# Altium schematic sheet [15] - MISC, JTAG, HEADERS.SchDoc
size A3; DocumentNumber: 2; SheetNumber: 15; SheetTotal: 20
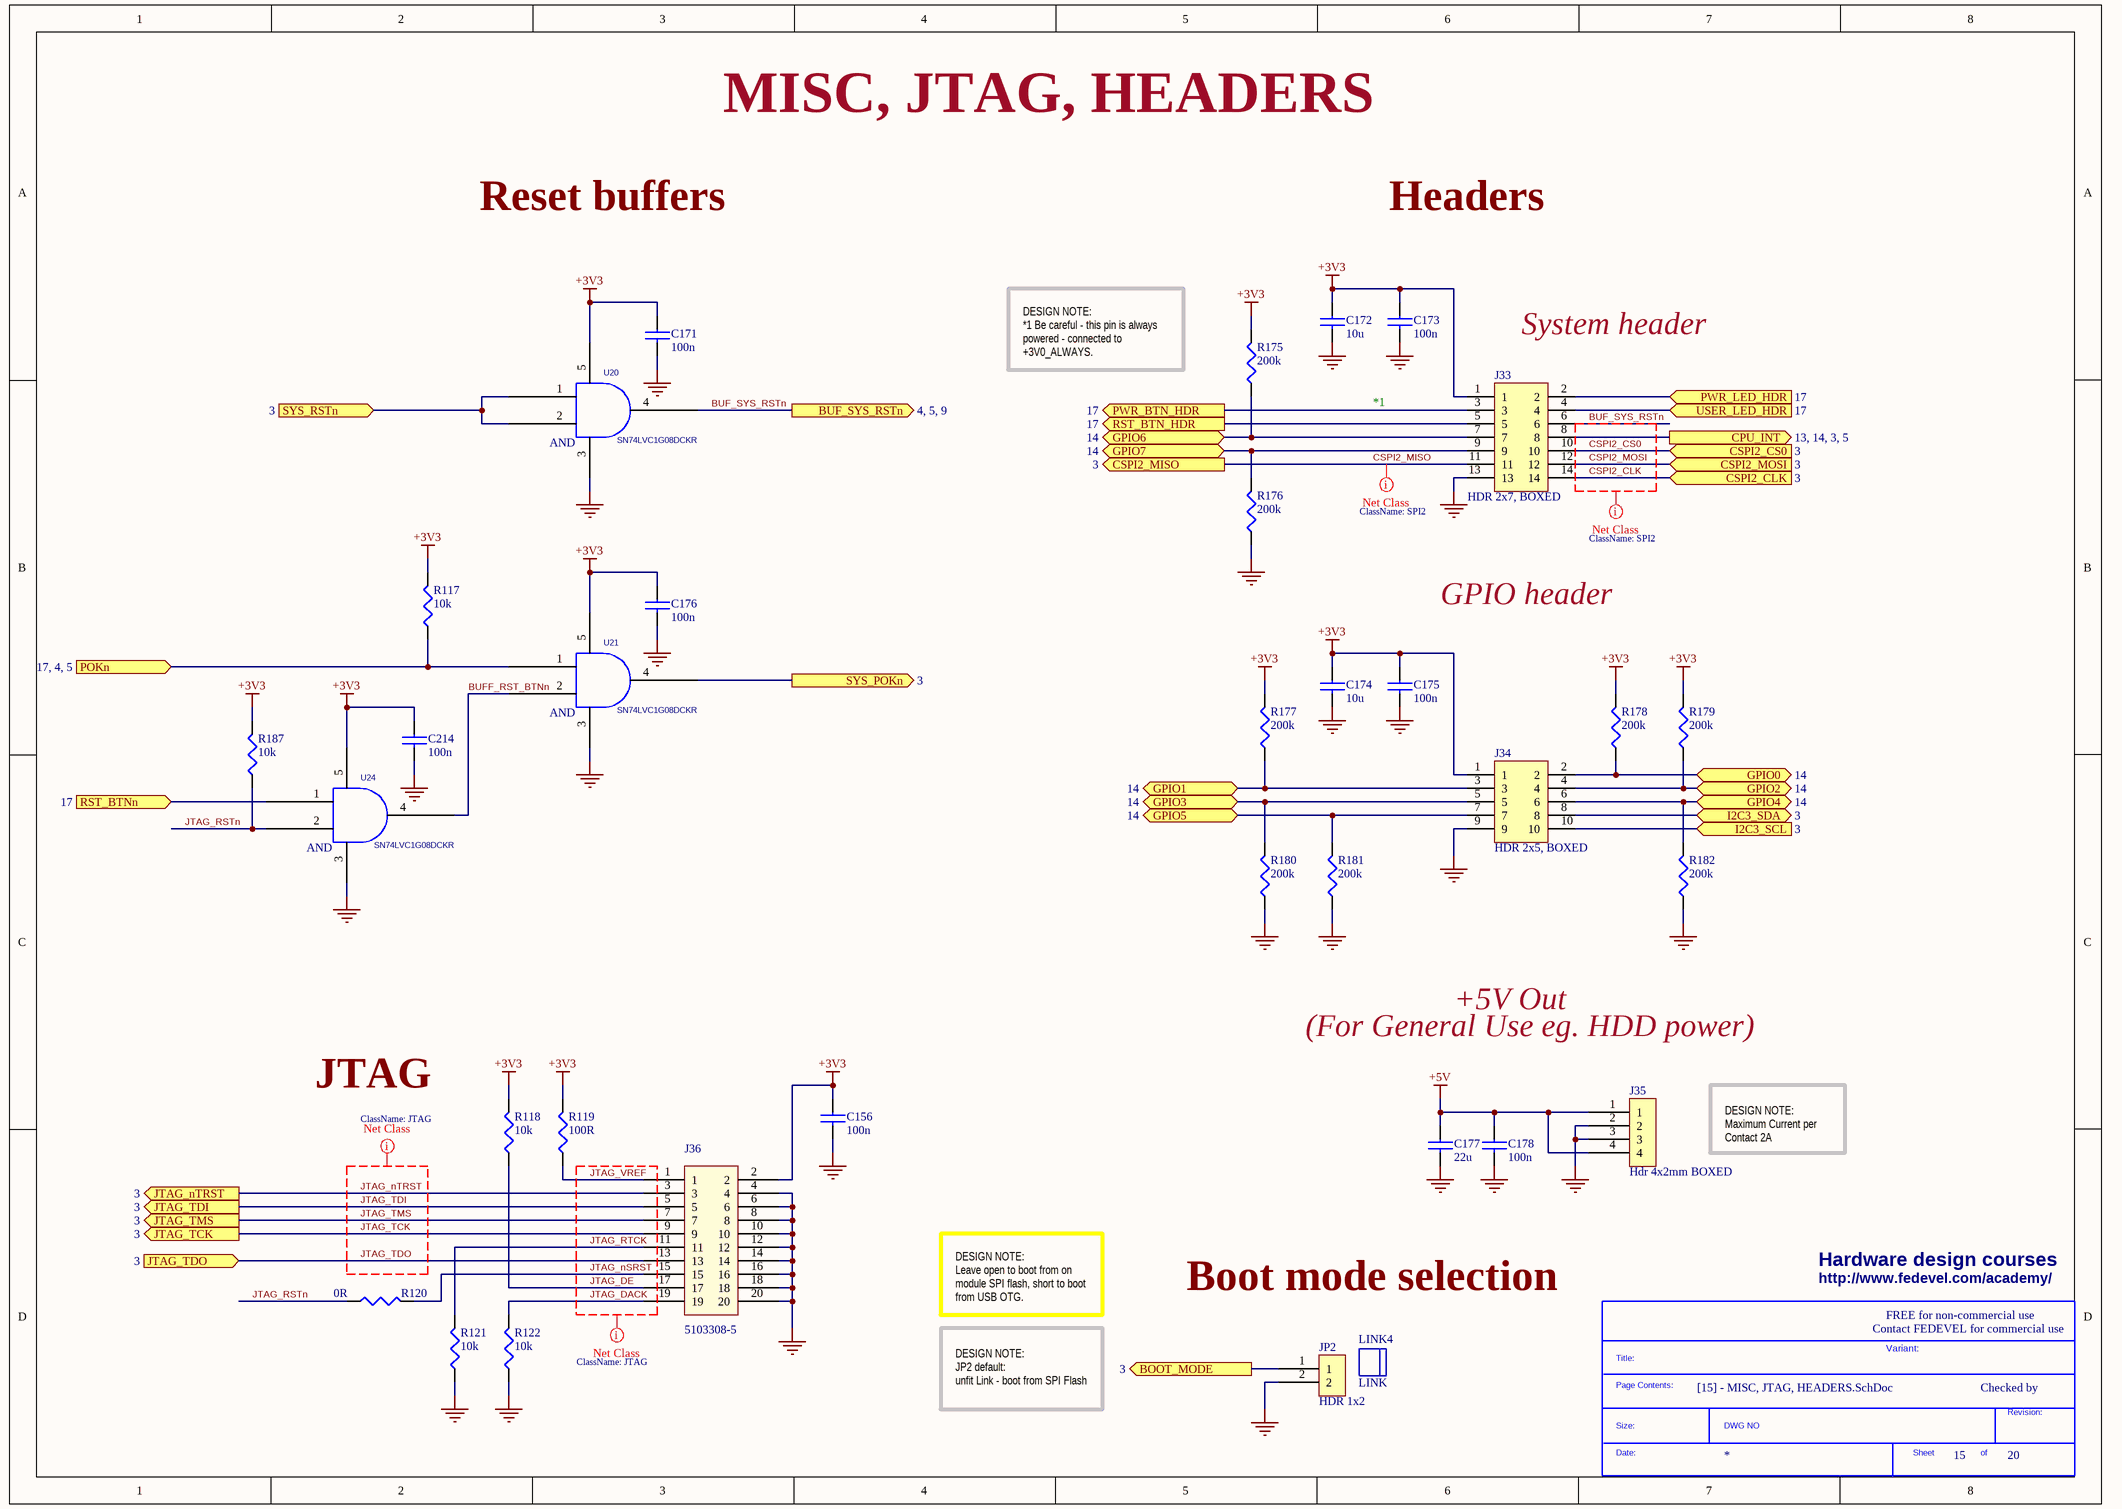
[diagram p0: [15] - MISC, JTAG, HEADERS.SchDoc]

## Parts
*  SDTitleBlock  (value not drawn)  (graphical)
C156  100n  [C0402]
C171  100n  [C0402]
C172  10u  [C0603]
C173  100n  [C0402]
C174  10u  [C0603]
C175  100n  [C0402]
C176  100n  [C0402]
C177  22u  [C0805]
C178  100n  [C0402]
C214  100n  [C0402]
J33  HDR 2x7, BOXED  [HDR_2x7_2.54MM_BOXED]
J34  HDR 2x5, BOXED  [HDR_2x5_2.54mm_BOXED]
J35  Hdr 4x2mm BOXED  [HDR_1x4_2MM_SHDR]
J36  5103308-5  [HDR_2x10_2.54mm_BOXED]
JP2  HDR 1x2  [HDR_1x2_2.54MM]
LINK4  LINK  (mechanical)
R117  10k  [R0402]
R118  10k  [R0402]
R119  100R  [R0402]
R120  0R  [R0402]
R121  10k  [R0402]
R122  10k  [R0402]
R175  200k  [R0402]
R176  200k  [R0402]
R177  200k  [R0402]
R178  200k  [R0402]
R179  200k  [R0402]
R180  200k  [R0402]
R181  200k  [R0402]
R182  200k  [R0402]
R187  10k  [R0402]
U20  SN74LVC1G08DCKR  [SC70_5]
U21  SN74LVC1G08DCKR  [SC70_5]
U24  SN74LVC1G08DCKR  [SC70_5]

## Ports
BOOT_MODE (out, see 3), BUF_SYS_RSTn (see 4, 5, 9), CPU_INT (out, see 13, 14, 3, 5), CSPI2_CLK (in, see 3), CSPI2_CS0 (in, see 3), CSPI2_MISO (out, see 3), CSPI2_MOSI (in, see 3), GPIO0 (bidir, see 14), GPIO1 (bidir, see 14), GPIO2 (bidir, see 14), GPIO3 (bidir, see 14), GPIO4 (bidir, see 14), GPIO5 (bidir, see 14), GPIO6 (bidir, see 14), GPIO7 (bidir, see 14), I2C3_SCL (in, see 3), I2C3_SDA (bidir, see 3), JTAG_nTRST (out, see 3), JTAG_TCK (out, see 3), JTAG_TDI (out, see 3), JTAG_TDO (in, see 3), JTAG_TMS (out, see 3), POKn (see 17, 4, 5), PWR_BTN_HDR (out, see 17), PWR_LED_HDR (in, see 17), RST_BTN_HDR (out, see 17), RST_BTNn (in, see 17), SYS_POKn (out, see 3), SYS_RSTn (in, see 3), USER_LED_HDR (in, see 17)

## Nets
+3V3: C156.1 C171.1 C172.1 C173.1 C174.1 C175.1 C176.1 C214.1 J33.1 J34.1 J36.2 R117.2 R118.2 R119.2 R175.2 R177.2 R178.2 R179.2 R187.2 U20.5(VCC) U21.5(VCC) U24.5(VCC)
+5V: C177.1 C178.1 J35.1 J35.4
GND: C156.2 C171.2 C172.2 C173.2 C174.2 C175.2 C176.2 C177.2 C178.2 C214.2 J33.13 J34.9 J35.2 J35.3 J36.4 J36.6 J36.8 J36.10 J36.12 J36.14 J36.16 J36.18 J36.20 JP2.2 R121.1 R122.1 R176.1 R180.1 R181.1 R182.1 U20.3(GND) U21.3(GND) U24.3(GND)
BOOT_MODE: JP2.1 ; port BOOT_MODE
BUF_SYS_RSTn: J33.6 U20.4(Y) ; port BUF_SYS_RSTn
BUFF_RST_BTNn: U21.2(B) U24.4(Y)
CPU_INT: J33.8 ; port CPU_INT
CSPI2_CLK: J33.14 ; port CSPI2_CLK
CSPI2_CS0: J33.10 ; port CSPI2_CS0
CSPI2_MISO: J33.11 ; port CSPI2_MISO
CSPI2_MOSI: J33.12 ; port CSPI2_MOSI
GPIO0: J34.2 R178.1 ; port GPIO0
GPIO1: J34.3 R177.1 ; port GPIO1
GPIO2: J34.4 R179.1 ; port GPIO2
GPIO3: J34.5 R180.2 ; port GPIO3
GPIO4: J34.6 R182.2 ; port GPIO4
GPIO5: J34.7 R181.2 ; port GPIO5
GPIO6: J33.7 R175.1 ; port GPIO6
GPIO7: J33.9 R176.2 ; port GPIO7
I2C3_SCL: J34.10 ; port I2C3_SCL
I2C3_SDA: J34.8 ; port I2C3_SDA
JTAG_DACK: J36.19 R122.2
JTAG_DE: J36.17 R118.1
JTAG_nSRST: J36.15 R120.2
JTAG_nTRST: J36.3 ; port JTAG_nTRST
JTAG_RSTn: R120.1 R187.1 U24.2(B)
JTAG_RTCK: J36.11 R121.2
JTAG_TCK: J36.9 ; port JTAG_TCK
JTAG_TDI: J36.5 ; port JTAG_TDI
JTAG_TDO: J36.13 ; port JTAG_TDO
JTAG_TMS: J36.7 ; port JTAG_TMS
JTAG_VREF: J36.1 R119.1
POKn: R117.1 U21.1(A) ; port POKn
PWR_BTN_HDR: J33.3 ; port PWR_BTN_HDR
PWR_LED_HDR: J33.2 ; port PWR_LED_HDR
RST_BTN_HDR: J33.5 ; port RST_BTN_HDR
RST_BTNn: U24.1(A) ; port RST_BTNn
SYS_POKn: U21.4(Y) ; port SYS_POKn
SYS_RSTn: U20.1(A) U20.2(B) ; port SYS_RSTn
USER_LED_HDR: J33.4 ; port USER_LED_HDR

## Layout directives
net class JTAG: JTAG_DACK, JTAG_DE, JTAG_nSRST, JTAG_nTRST, JTAG_RTCK, JTAG_TCK, JTAG_TDI, JTAG_TDO, JTAG_TMS, JTAG_VREF
net class SPI2: BUF_SYS_RSTn, CSPI2_CLK, CSPI2_CS0, CSPI2_MISO, CSPI2_MOSI

## Notes on the sheet
- MISC, JTAG, HEADERS
- Reset buffers
- Headers
- DESIGN NOTE:
  *1 Be careful - this pin is always powered - connected to +3V0_ALWAYS.
- System header
- *1
- GPIO header
- (For General Use eg. HDD power)
- +5V Out
- JTAG
- DESIGN NOTE:
  Maximum Current per Contact 2A
- Hardware design courses
- DESIGN NOTE:
  Leave open to boot from on module SPI flash, short to boot from USB OTG.
- (near *) Boot mode selection
- http://www.fedevel.com/academy/
- Contact FEDEVEL for commercial use
- FREE for non-commercial use
- Variant:
- Checked by
- DESIGN NOTE:
  JP2 default:
  unfit Link - boot from SPI Flash
- (in symbol SDTitleBlock) Title:; Page Contents:; Revision:; Size:; DWG NO; Date:; Sheet; of
- (in symbol SN74LVC1G08DCKR) AND

## Library data of the parts
C156 C171 C173 C175 C176 C178 C214 = C1005X5R1H104K: CAP CER .10UF 50V X5R 10% 0402; Manufacturer: TDK Corporation; Capacitance: 0.1µF; Value: 100nF; .Checked PCB: used; Description: CAP CER 0.1UF 50V 10% X5R 0402; Category: Capacitors; Supplier Part Number: 445-5942-1-ND; Manufacturer Part Number: C1005X5R1H104K; Operating Temperature: -55°C ~ 85°C; Package / Case: 0402 (1005 Metric); Price 1k [$]: 0.02340; .Checked SCH: used; Voltage - Rated: 50V; Supplier: Digikey; Supplier 1: Digi-Key; Supplier Part Number 1: 445-5942-1-ND; RoHS: RoHS Compliant; Stock 1: 106926; Pricing 1: 1=0.27, 10=0.18, 100=0.072, 250=0.05176, 500=0.0369, 1000=0.027 (USD); Tolerance: ±10%; Temperature Coefficient: X5R; Mounting Type: Surface Mount, MLCC; Applications: General Purpose; Ratings: -; Size / Dimension: 0.039" L x 0.020" W (1.00mm x 0.50mm); Height - Seated (Max): -; Thickness (Max): 0.022" (0.55mm); Lead Spacing: -; Features: -; Packaging: Cut Tape (CT); Lead Style: -; ComponentLink1URL: http://www.tdk.co.jp/tefe02/e412_c.pdf; ComponentLink1Description: http://www.tdk.co.jp/tefe02/e412_c.pdf
C172 C174 = C1608X5R0J106M: CAP CER 10UF 6.3V X5R 20% 0603; Manufacturer: TDK Corporation; Capacitance: 10µF; Value: 10µF; .Checked PCB: used; Description: CAP CER 10UF 6.3V 20% X5R 0603; Category: Capacitors; Supplier Part Number: 445-4112-1-ND; Manufacturer Part Number: C1608X5R0J106M; Operating Temperature: -55°C ~ 85°C; Package / Case: 0603 (1608 Metric); Price 1k [$]: 0.08580; .Checked SCH: used; Voltage - Rated: 6.3V; Features: Low ESR; Supplier: Digikey; Supplier 1: Digi-Key; Supplier Part Number 1: 445-4112-1-ND; RoHS: RoHS Compliant; Stock 1: 48157; Pricing 1: 1=0.46, 10=0.363, 100=0.1898, 250=0.14024, 500=0.1089, 1000=0.0858 (USD); Tolerance: ±20%; Temperature Coefficient: X5R; Mounting Type: Surface Mount, MLCC; Applications: General Purpose; Ratings: -; Size / Dimension: 0.063" L x 0.031" W (1.60mm x 0.80mm); Height - Seated (Max): -; Thickness (Max): 0.037" (0.95mm); Lead Spacing: -; Packaging: Cut Tape (CT); Lead Style: -; ComponentLink1URL: http://www.tdk.com/pdf/general_B11.pdf; ComponentLink1Description: http://www.tdk.com/pdf/general_B11.pdf
C177 = C2012X5R1C226K: CAP CER 22UF 16V 10% X5R 0805; Manufacturer: TDK Corporation; Capacitance: 22µF; .Checked PCB: RF; Supplier 1: Digi-Key; Supplier Part Number 1: 445-6797-1-ND; Manufacturer Part Number: C2012X5R1C226K; RoHS: RoHS Compliant; Category: Capacitors; Stock 1: 15408; Pricing 1: 1=0.77, 10=0.737, 100=0.3575, 250=0.297, 500=0.2695, 1000=0.2475 (USD); Voltage - Rated: 16V; Tolerance: ±10%; Temperature Coefficient: X5R; Mounting Type: Surface Mount, MLCC; Operating Temperature: -55°C ~ 85°C; Applications: General Purpose; Ratings: -; Package / Case: 0805 (2012 Metric); Size / Dimension: 0.079" L x 0.049" W (2.00mm x 1.25mm); Height - Seated (Max): -; Thickness (Max): 0.057" (1.45mm); Lead Spacing: -; Features: -; Packaging: Cut Tape (CT); Lead Style: -; ComponentLink1URL: http://www.tdk.com/pdf/general_B11.pdf; ComponentLink1Description: http://www.tdk.com/pdf/general_B11.pdf; .Checked SCH: RF
J33 = D2514-6002-AR: CONN HEADER 14POS VERT 10GOLD; Manufacturer: 3M; Connector Type: Header, Shrouded; Number of Positions: 14; Number of Positions Loaded: All; Pitch: 0.100" (2.54mm); .Creator: MM; Supplier 1: Digi-Key; Manufacturer Part Number: D2514-6002-AR; RoHS: RoHS Compliant; Category: Connectors, Interconnects; Stock 1: 5967; Pricing 1: 1=1.62, 10=1.47, 50=1.32, 100=1.26, 250=1.14, 500=1.05, 1000=0.9, 2500=0.84, 5000=0.798 (USD); Packaging: Bulk; Contact Type: Male Pin; Number of Rows: 2; Row Spacing: 0.100" (2.54mm); Contact Mating Length: 0.243" (6.17mm); Mounting Type: Through Hole; Termination: Solder; Fastening Type: -; Features: -; Contact Finish: Gold; Contact Finish Thickness: 10µin (0.25µm); Color: Black; ComponentLink1URL: http://multimedia.3m.com/mws/mediawebserver?66666UuZjcFSLXTtm8T_oxMcEVuQEcuZgVs6EVs6E666666--; ComponentLink1Description: http://multimedia.3m.com/mws/mediawebserver?66666UuZjcFSLXTtm8T_oxMcEVuQEcuZgVs6EVs6E666666--; Supplier Part Number 1: MHC14E-ND; .Checked PCB: MM; .Checked SCH: MM
J34 = D2510-6002-AR: CONN HEADER 10POS VERT 10GOLD; Manufacturer: 3M; Connector Type: Header, Shrouded; Number of Positions: 10; Number of Positions Loaded: All; Pitch: 0.100" (2.54mm); .Creator: MM; Supplier 1: Digi-Key; Manufacturer Part Number: D2510-6002-AR; RoHS: RoHS Compliant; Category: Connectors, Interconnects; Stock 1: 1080; Pricing 1: 1=1.57, 10=1.421, 50=1.276, 100=1.218, 250=1.102, 500=1.015, 1000=0.87, 2500=0.812, 5000=0.7714 (USD); Packaging: Bulk; Contact Type: Male Pin; Number of Rows: 2; Row Spacing: 0.100" (2.54mm); Contact Mating Length: 0.243" (6.17mm); Mounting Type: Through Hole; Termination: Solder; Fastening Type: -; Features: -; Contact Finish: Gold; Contact Finish Thickness: 10µin (0.25µm); Color: Black; ComponentLink1URL: http://multimedia.3m.com/mws/mediawebserver?66666UuZjcFSLXTtm8T_oxMcEVuQEcuZgVs6EVs6E666666--; ComponentLink1Description: http://multimedia.3m.com/mws/mediawebserver?66666UuZjcFSLXTtm8T_oxMcEVuQEcuZgVs6EVs6E666666--; Supplier Part Number 1: MHC10E-ND; .Checked PCB: MM; .Checked SCH: MM
J35 = 0532530470: CONN HEADER 4POS 2MM VERT TIN; Manufacturer: Molex Inc; Connector Type: Header, Shrouded; Number of Positions: 4; Number of Positions Loaded: All; Pitch: 0.079" (2.00mm); .Creator: MM; Supplier 1: Digi-Key; Manufacturer Part Number: 0532530470; RoHS: RoHS Compliant; Category: Connectors, Interconnects; Stock 1: 5160; Pricing 1: 1=0.23, 10=0.211, 50=0.1576, 100=0.1464, 250=0.12948, 500=0.12386, 1000=0.10134, 2500=0.0929, 5000=0.09008 (USD); Packaging: Tray; Contact Type: Male Pin; Number of Rows: 1; Row Spacing: -; Contact Mating Length: 0.130" (3.30mm); Mounting Type: Through Hole; Termination: Press-Fit; Fastening Type: -; Features: -; Contact Finish: Tin; Contact Finish Thickness: -; Color: -; ComponentLink1URL: http://www.molex.com/pdm_docs/sd/532530270_sd.pdf; ComponentLink1Description: http://www.molex.com/pdm_docs/sd/532530270_sd.pdf; Supplier Part Number 1: WM19006-ND; .Checked PCB: MM; .Checked SCH: MM
J36 = 5103308-5: CONN HEADER LOPRO STR 20POS GOLD; Manufacturer: TE Connectivity; Connector Type: Header, Shrouded; Number of Positions: 20; Number of Positions Loaded: All; Pitch: 0.100" (2.54mm); .Creator: MM; Supplier 1: Digi-Key; Manufacturer Part Number: 5103308-5; RoHS: RoHS Compliant; Category: Connectors, Interconnects; Stock 1: 3482; Pricing 1: 1=1.9, 25=1.6212, 50=1.5508, 100=1.4803, 250=1.33928, 500=1.23356, 1000=1.05734, 2500=0.98685, 5000=0.9375 (USD); Packaging: Tube; Contact Type: Male Pin; Number of Rows: 2; Row Spacing: 0.100" (2.54mm); Contact Mating Length: 0.240" (6.10mm); Mounting Type: Through Hole; Termination: Solder; Fastening Type: -; Features: -; Contact Finish: Gold or Gold-Palladium; Contact Finish Thickness: 15µin (0.38µm); Color: Black; ComponentLink1URL: http://www.te.com/commerce/DocumentDelivery/DDEController?Action=srchrtrv&DocNm=5103308&DocType=Customer+Drawing&DocLang=English; ComponentLink1Description: http://www.te.com/commerce/DocumentDelivery/DDEController?Action=srchrtrv&DocNm=5103308&DocType=Customer+Drawing&DocLang=English; Supplier Part Number 1: A33165-ND; .Checked PCB: MM; .Checked SCH: MM
JP2 = 68001-202HLF: BERGSTIK II .100" SR STRAIGHT; Manufacturer: FCI; Connector Type: Header, Unshrouded; Number of Positions: 2; Number of Positions Loaded: All; Pitch: 0.100" (2.54mm); .Checked PCB: RF; Supplier 1: Digi-Key; Supplier Part Number 1: 609-3469-ND; Manufacturer Part Number: 68001-202HLF; RoHS: RoHS Compliant; Category: Connectors, Interconnects; Stock 1: 13680; Pricing 1: 1=0.45, 10=0.265, 100=0.1172, 250=0.09828, 500=0.09072, 1000=0.07938, 5000=0.05065 (USD); Contact Type: Male Pin; Number of Rows: 1; Row Spacing: -; Contact Mating Length: 0.230" (5.84mm); Mounting Type: Through Hole; Termination: Solder; Fastening Type: -; Features: -; Contact Finish: Gold; Contact Finish Thickness: 15µin (0.38µm); Color: Black; Packaging: Bulk; ComponentLink1URL: http://portal.fciconnect.com/res/en/pdffiles/doc_search/68000.pdf; ComponentLink1Description: http://portal.fciconnect.com/res/en/pdffiles/doc_search/68000.pdf; .Checked SCH: RF
LINK4 = QPC02SXGN-RC: CONN JUMPER SHORTING .100" GOLD; Manufacturer: Sullins Connector Solutions; Gender: Female Sockets; Number of Positions or Pins (Grid): 2 (1 x 2); Pitch: 0.100" (2.54mm); .Checked SCH: RF; Supplier 1: Digi-Key; Supplier Part Number 1: S9337-ND; Manufacturer Part Number: QPC02SXGN-RC; RoHS: RoHS Compliant; Category: Connectors, Interconnects; Stock 1: 23274; Pricing 1: 1=0.11, 10=0.066, 25=0.0468, 50=0.0384, 100=0.033, 250=0.02792, 500=0.0258, 1000=0.0228, 2500=0.018 (USD); Type: Open Top; Height: 0.235" (5.97mm); Contact Finish: Gold; Contact Finish Thickness: Flash; Color: -; Packaging: Bulk; ComponentLink1URL: http://www.sullinscorp.com/drawings/284_SXGN_11510.pdf; ComponentLink1Description: http://www.sullinscorp.com/drawings/284_SXGN_11510.pdf
R117 R118 R121 R122 R187 = RC0402FR-0710KL: RES 10.0K OHM 1/16W 1% 0402 SMD; Manufacturer: Yageo; Power (Watts): 0.063W, 1/16W; .Checked PCB: used; Temperature Coefficient: ±100ppm/°C; Category: Resistors; Supplier Part Number: 311-10.0KLRCT-ND; Manufacturer Part Number: RC0402FR-0710KL; Package / Case: 0402 (1005 Metric); Price 1k [$]: 0.01421; Resistance (Ohms): 10K; Tolerance: ±1%; Value: 10k; .Checked SCH: used; Supplier: Digikey; Supplier 1: Digi-Key; Supplier Part Number 1: 311-10.0KLRCT-ND; RoHS: RoHS Compliant; Stock 1: 2916495; Pricing 1: 10=0.014, 50=0.0104, 100=0.0079, 250=0.00584, 500=0.00432, 1000=0.00288 (USD); Composition: Thick Film; Features: -; Size / Dimension: 0.039" L x 0.020" W (1.00mm x 0.50mm); Height: 0.016" (0.40mm); Number of Terminations: 2; Packaging: Cut Tape (CT); ComponentLink1URL: http://www.yageo.com/documents/recent/PYu-RC0402_51_RoHS_L_6.pdf; ComponentLink1Description: http://www.yageo.com/documents/recent/PYu-RC0402_51_RoHS_L_6.pdf
R119 = RC0402FR-07100RL: RES 100 OHM 1/16W 1% 0402 SMD; Manufacturer: Yageo; Resistance (Ohms): 100; Power (Watts): 0.063W, 1/16W; .Checked PCB: RF; Temperature Coefficient: ±100ppm/°C; Category: Resistors; Supplier Part Number: 311-100LRCT-ND; Manufacturer Part Number: RC0402FR-07100RL; Package / Case: 0402 (1005 Metric); Price 1k [$]: 0.01421; Tolerance: ±1%; Value: 100R; .Checked SCH: RF; Supplier: Digikey; Supplier 1: Digi-Key; Supplier Part Number 1: 311-100LRCT-ND; RoHS: RoHS Compliant; Stock 1: 1682040; Pricing 1: 10=0.014, 50=0.0104, 100=0.0079, 250=0.00584, 500=0.00432, 1000=0.00288 (USD); Composition: Thick Film; Features: -; Size / Dimension: 0.039" L x 0.020" W (1.00mm x 0.50mm); Height: 0.016" (0.40mm); Number of Terminations: 2; Packaging: Cut Tape (CT); ComponentLink1URL: http://www.yageo.com/documents/recent/PYu-RC0402_51_RoHS_L_6.pdf; ComponentLink1Description: http://www.yageo.com/documents/recent/PYu-RC0402_51_RoHS_L_6.pdf
R120 = RC0402JR-070RL: RES 0.0 OHM 1/16W 0402 SMD; Manufacturer: Yageo; Resistance (Ohms): 0.0; Power (Watts): 0.063W, 1/16W; Tolerance: Jumper; .Checked PCB: used; Category: Resistors; Supplier Part Number: 311-0.0JRCT-ND; Manufacturer Part Number: RC0402JR-070RL; Package / Case: 0402 (1005 Metric); Price 1k [$]: 0.01389; Value: 0R; .Checked SCH: used; Supplier: Digikey; Supplier 1: Digi-Key; Supplier Part Number 1: 311-0.0JRCT-ND; RoHS: RoHS Compliant; Stock 1: 1106330; Pricing 1: 10=0.012, 50=0.009, 100=0.0069, 250=0.00512, 500=0.0038, 1000=0.00253 (USD); Composition: Thick Film; Features: -; Temperature Coefficient: -; Size / Dimension: 0.039" L x 0.020" W (1.00mm x 0.50mm); Height: 0.016" (0.40mm); Number of Terminations: 2; Packaging: Cut Tape (CT); ComponentLink1URL: http://www.yageo.com/documents/recent/PYu-RC0402_51_RoHS_L_6.pdf; ComponentLink1Description: http://www.yageo.com/documents/recent/PYu-RC0402_51_RoHS_L_6.pdf
R175-R182 = RC0402FR-07200KL: RES 200K OHM 1/16W 1% 0402 SMD; Manufacturer: Yageo; Power (Watts): 0.063W, 1/16W; .Checked PCB: used; Temperature Coefficient: ±100ppm/°C; Category: Resistors; Supplier Part Number: 311-200KLRCT-ND; Manufacturer Part Number: RC0402FR-07200KL; Package / Case: 0402 (1005 Metric); Price 1k [$]: 0.01421; Resistance (Ohms): 200K; Tolerance: ±1%; Value: 200k; .Checked SCH: used; Supplier: Digikey; Supplier 1: Digi-Key; Supplier Part Number 1: 311-200KLRCT-ND; RoHS: RoHS Compliant; Stock 1: 225869; Pricing 1: 10=0.014, 50=0.0104, 100=0.0079, 250=0.00584, 500=0.00432, 1000=0.00288 (USD); Composition: Thick Film; Features: -; Size / Dimension: 0.039" L x 0.020" W (1.00mm x 0.50mm); Height: 0.016" (0.40mm); Number of Terminations: 2; Packaging: Cut Tape (CT); ComponentLink1URL: http://www.yageo.com/documents/recent/PYu-RC0402_51_RoHS_L_6.pdf; ComponentLink1Description: http://www.yageo.com/documents/recent/PYu-RC0402_51_RoHS_L_6.pdf
U20 U21 U24 = SN74LVC1G08DCKR: SINGLE POSITIVE AND GATE SC-70; Manufacturer: Texas Instruments; .Checked PCB: used; Number of Inputs: 2; Voltage - Supply: 1.65 V ~ 5.5 V; Number of Circuits: 1; Current - Output High, Low: 32mA, 32mA; .Checked SCH: used; Category: Integrated Circuits (ICs); Supplier Part Number: 296-11602-1-ND; Family: Logic - Gates and Inverters; Manufacturer Part Number: SN74LVC1G08DCKR; Operating Temperature: -40°C ~ 85°C; Package / Case: 6-TSSOP (5 lead), SC-88A, SOT-353; Price 1k [$]: 0.11250; Value: SN74LVC1G08DCKR; Logic Type: AND Gate; Supplier: Digikey; Supplier 1: Digi-Key; Supplier Part Number 1: 296-11602-1-ND; RoHS: RoHS Compliant; Stock 1: 36212; Pricing 1: 1=0.7, 25=0.322, 100=0.224, 250=0.1596, 500=0.1218, 1000=0.084 (USD); Mounting Type: Surface Mount; Supplier Device Package: SC-70-5; Packaging: Cut Tape (CT); ComponentLink1URL: http://www.ti.com/lit/ds/symlink/sn74lvc1g08.pdf; ComponentLink1Description: http://www.ti.com/lit/ds/symlink/sn74lvc1g08.pdf